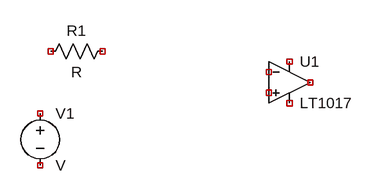
[diagram p0: schematic Draft1.asc]
Draft1.asc, the LTspice schematic file:
Version 4
SHEET 1 880 680
SYMBOL Comparators\\LT1017 288 128 R0
SYMATTR InstName U1
SYMBOL voltage -96 160 R0
SYMATTR InstName V1
SYMBOL res 16 64 R90
WINDOW 0 0 56 VBottom 2
WINDOW 3 32 56 VTop 2
SYMATTR InstName R1

The netlist it stands for:
* Draft1.asc
XU1 NC_01 NC_02 NC_03 NC_04 NC_05 LT1017  ; pins In+ In- V+ V- OUT
V1 NC_06 NC_07 V
R1 NC_08 NC_09 R
.backanno
.end